# EAGLE design usb-relais-notsmd (EAGLE 5.03)
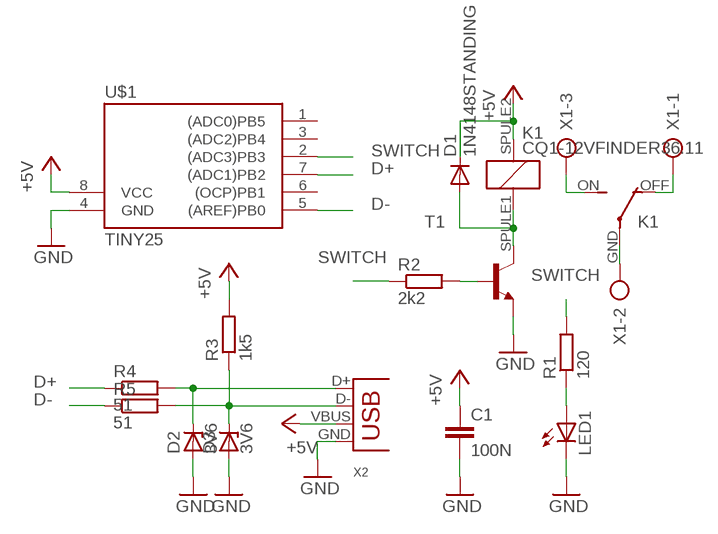
[diagram p0: schematic, sheet 1]

## Parts
C1  100N  C-EU025-024X044  [C025-024X044]
D1  1N4148STANDING  [DO35-3]
D2  3V6  ZENER-DIODEDO35-3  [DO35-3]
D3  3V6  ZENER-DIODEDO35-3  [DO35-3]
K1  CQ1-12VFINDER36.11  [FINDER-36.11]
LED1  LED3MM  [LED3MM]
R1  120  R-EU_0207/2V  [0207/2V]
R2  2k2  R-EU_0207/2V  [0207/2V]
R3  1k5  R-EU_0207/2V  [0207/2V]
R4  51  R-EU_0207/2V  [0207/2V]
R5  51  R-EU_0207/2V  [0207/2V]
T1  BC548C-NPN-TO92-EBC  [TO92-EBC]
U$1  TINY25  [DIL08]
X1  AK500/3  [AK500/3]
X2  USB-B-H  [USB-B-H]

## Nets
+5V: C1.1 D1.C K1.SPULE2 R3.2 U$1.8(VCC) X2.VBUS
D+: R4.1 U$1.7((ADC1)PB2)
D-: R5.1 U$1.5((AREF)PB0)
GND: C1.2 D2.A D3.A LED1.K(C) T1.E U$1.4(GND) X2.GND
N$1: D1.A K1.SPULE1 T1.C
N$2: K1.OFF(2:O) X1.1
N$3: K1.GND(2:P) X1.2
N$4: K1.ON(2:S) X1.3
N$5: LED1.A R1.1
N$6: R2.2 T1.B
N$7: D3.C R3.1 R5.2 X2.D-
N$8: D2.C R4.2 X2.D+
SWITCH: R1.2 R2.1 U$1.2((ADC3)PB3)
Unconnected: U$1.1((ADC0)PB5) U$1.3((ADC2)PB4) U$1.6((OCP)PB1)

## Library data of the parts
C1 = rcl:C-EU: CAPACITOR, European symbol
D1 = diode:1N4148: DIODE high speed (Philips)
D2 D3 = diode:ZENER-DIODE: Z-Diode
K1 = relay:CQ1-12V: AUTOMOTIVE QUIET RELAY NAiS Source: http://www.mew-europe.com/.. en_ds_61208_0000.pdf
LED1 = led:LED: LED OSRAM: - CHIPLED LG R971, LG N971, LY N971, LG Q971, LY Q971, LO R971, LY R971 LH N974, LH R974 LS Q976, LO Q976, LY Q976 LO Q996 - Hyper CHIPLED LW Q18S LB Q993, LB Q99A, LB R99A - SideLED LS A670, LO A670, LY A670, LG A670, LP A670 LB A673, LV A673, LT A673, LW A673 LH A674 LY A675 LS A676, LA A676, LO A676, LY A676, LW A676 LS A679, LY A679, LG A679 - Hyper Micro SIDELED® LS Y876, LA Y876, LO Y876, LY Y876 LT Y87S - SmartLED LW L88C, LW L88S LB L89C, LB L89S, LG L890 LS L89K, LO L89K, LY L89K LS L896, LA L896, LO L896, LY L896 - TOPLED LS T670, LO T670, LY T670, LG T670, LP T670 LSG T670, LSP T670, LSY T670, LOP T670, LYG T670 LG T671, LOG T671, LSG T671 LB T673, LV T673, LT T673, LW T673 LH T674 LS T676, LA T676, LO T676, LY T676, LB T676, LH T676, LSB T676, LW T676 LB T67C, LV T67C, LT T67C, LS T67K, LO T67K, LY T67K, LW E67C LS E67B, LA E67B, LO E67B, LY E67B, LB E67C, LV E67C, LT E67C LW T67C LS T679, LY T679, LG T679 LS T770, LO T770, LY T770, LG T770, LP T770 LB T773, LV T773, LT T773, LW T773 LH T774 LS E675, LA E675, LY E675, LS T675 LS T776, LA T776, LO T776, LY T776, LB T776 LHGB T686 LT T68C, LB T68C - Hyper Mini TOPLED® LB M676 - Mini TOPLED Santana® LG M470 LS M47K, LO M47K, LY M47K Source: http://www.osram.convergy.de LUXEON: - LUMILED® LXK2-PW12-R00, LXK2-PW12-S00, LXK2-PW14-U00, LXK2-PW14-V00 LXK2-PM12-R00, LXK2-PM12-S00, LXK2-PM14-U00 LXK2-PE12-Q00, LXK2-PE12-R00, LXK2-PE12-S00, LXK2-PE14-T00, LXK2-PE14-U00 LXK2-PB12-K00, LXK2-PB12-L00, LXK2-PB12-M00, LXK2-PB14-N00, LXK2-PB14-P00, LXK2-PB14-Q00 LXK2-PR12-L00, LXK2-PR12-M00, LXK2-PR14-Q00, LXK2-PR14-R00 LXK2-PD12-Q00, LXK2-PD12-R00, LXK2-PD12-S00 LXK2-PH12-R00, LXK2-PH12-S00 LXK2-PL12-P00, LXK2-PL12-Q00, LXK2-PL12-R00 Source: www.luxeon.com KINGBRIGHT: KA-3528ASYC Source: www.kingbright.com
R1-R5 = rcl:R-EU_: RESISTOR, European symbol
T1 = transistor:*-NPN-: NPN Transistror BF959 corrected 2008.03.06
U$1 = avr-4:TINY25
X1 = con-ptr500:AK500/3: CONNECTOR
X2 = con-usb-3:USB: USB Connectors

## Board
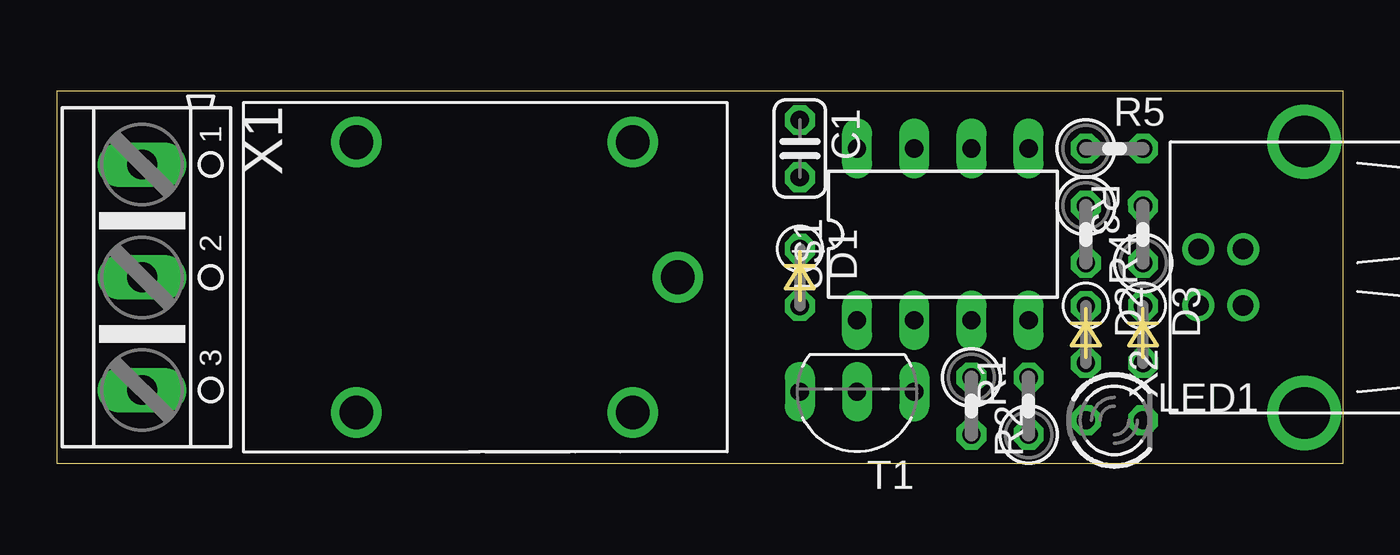
[diagram p1: board, top side]
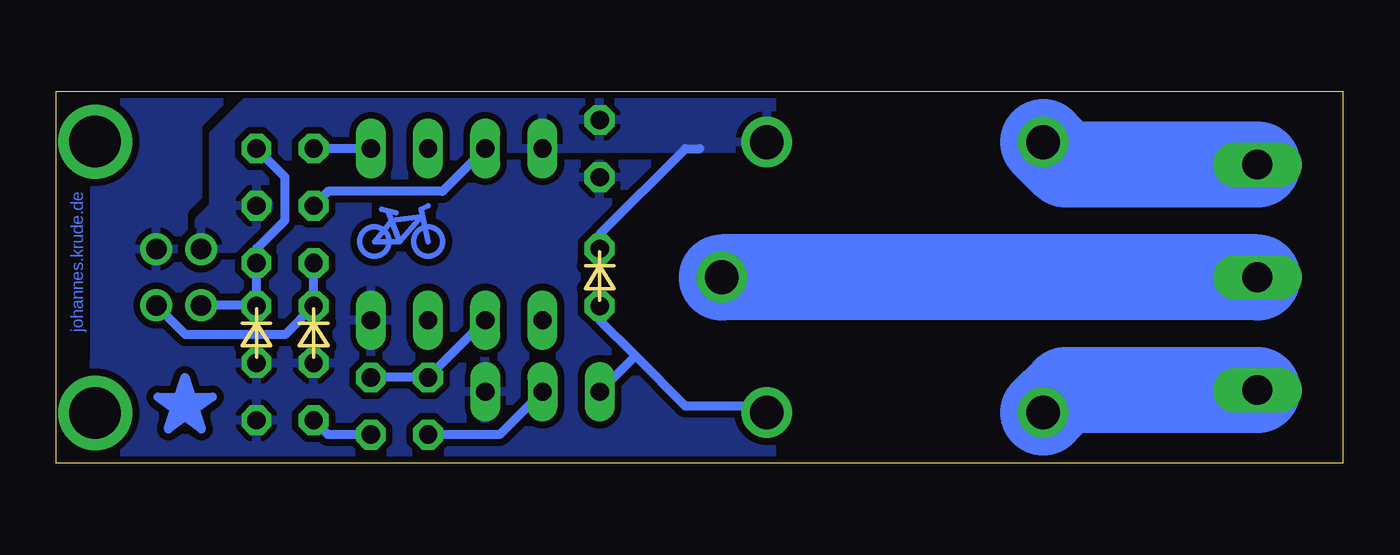
[diagram p2: board, bottom side, seen from below]

Size 57.14 x 16.5 mm. Coordinates in mm from the lower left corner, seen from the top.
Outline: 57.14,16.5 0,16.5 0,0 57.14,0 57.14,16.5
Copper layers (1*16): Top 0.035mm / dielectric 1.5mm / Bottom 0.035mm
Design rules "bÃ¼geln": minimum track width 10mil, minimum drill 24mil, track to track 12mil, track to pad 12mil, pad to pad 8mil, via to via 8mil, smd to smd 8mil, copper to edge 12mil, drill to drill 8mil, minimum pad ring 10mil, minimum via ring 8mil, stop-mask expansion 4mil, vias tented up to drill 0mil, thermal gap 10mil

### Footprints (pad centres in the part's own frame; a part is rotated, then mirrored left to right if it is on the bottom)
C025-024X044 = drill 0.813 octagon: 1 -1.27,0; 2 1.27,0
DO35-3 = drill 0.813 octagon: A 1.27,0; C -1.27,0
FINDER-36.11 = drill 1.5 round: GND -8.55,0; OFF 5.72,-6; ON 5.72,6; SPULE1 -6.55,6; SPULE2 -6.55,-6
LED3MM = drill 0.813 octagon: A -1.27,0; K 1.27,0
0207/2V = drill 0.813 octagon: 1 -1.27,0; 2 1.27,0
TO92-EBC = drill 0.813 long: B 0,-1.27; C 2.54,-1.27; E -2.54,-1.27
DIL08 = drill 0.813 long: 1 -3.81,-3.81; 2 -1.27,-3.81; 3 1.27,-3.81; 4 3.81,-3.81; 5 3.81,3.81; 6 1.27,3.81; 7 -1.27,3.81; 8 -3.81,3.81
AK500/3 = drill 1.321 long: 1 -5.004,0; 2 0,0; 3 5.004,0
USB-B-H = drill 0.914 round: D+ 0,1.25; D- 1.981,1.25; GND 0,-1.25; VBUS 1.981,-1.25 | drill 2.286 round: P$1 -2.718,-6.02; P$2 -2.718,6.02

### Placement (x,y rotation side)
C1  33.01,13.96 270 top
D1  33.01,8.25 270 top
D2  45.71,5.71 270 top
D3  48.25,5.71 270 top
K1  19.04,8.25 180 top
LED1  46.98,1.9 0 top
R1  43.17,2.53 90 top
R2  40.63,2.53 270 top
R3  48.25,10.15 90.1 top
R4  45.71,10.15 270 top
R5  46.98,13.96 0 top
T1  35.55,1.9 180 top
U$1  39.36,10.15 0 top
X1  3.8,8.25 270 top
X2  52.69,8.25 180 top

### Tracks (layer width: path | path; a pad name or v marks a point on that pad's centre or on a via)
+5V
  Bottom 0.406: D1.C 33.01,10.15 29.2,13.96 28.56,13.96
  pour Bottom: 48.25,16.5 25.39,16.5 25.39,13.96 38.09,13.96 38.09,12.69 47.61,12.69 47.61,9.52 50.79,9.52 50.79,10.79 50.15,11.42 50.15,14.6
D+
  Bottom 0.406: U$1.7 39.99,12.05 45.07,12.05 R4.1
D-
  Bottom 0.406: U$1.5 R5.1
GND
  pour Bottom (rank 2): 57.14,16.5 25.39,16.5 25.39,13.96 28.56,13.96 33.01,9.52 33.01,6.98 28.56,2.53 25.39,2.53 25.39,-0.01 57.14,-0.01
N$1
  Bottom 0.406: D1.A 33.01,6.34 31.42,4.75 | 31.42,4.75 29.2,2.53 25.87,2.53 K1.SPULE1 | 31.42,4.75 T1.C
N$2
  Bottom 3.81: X1.1 12.32,13.25 K1.OFF
N$3
  Bottom 3.81: X1.2 K1.GND
N$4
  Bottom 3.81: X1.3 12.32,3.24 K1.ON
N$5
  Bottom 0.406: R1.1 45.07,1.26 LED1.A
N$6
  Bottom 0.406: T1.B 37.45,1.26 R2.2
N$7
  Bottom 0.406: X2.D- 48.27,7 D3.C R3.1 48.25,9.51 48.25,9.52 46.98,10.79 46.98,12.69 R5.2
N$8
  Bottom 0.406: R4.2 D2.C 46.98,5.71 51.4,5.71 X2.D+
N$9
  Bottom 0.254: 41.9,9.83 43.01,9.83 42.21,10.79 40.94,10.94 41.9,9.83 | 41.9,9.83 42.37,11.1
N$10
  Bottom 0.254: 40.63,9.83 40.94,11.26
N$11
  Bottom 0.254: 42.69,11.26 42.06,11.1
N$12
  Bottom 0.254: 40.63,11.42 40.95,11.26
N$13
  Bottom 0.406: 52.16,1.5 50.21,2.92 52.63,2.92 50.68,1.5 51.42,3.8
N$14
  Bottom 0.406: 52.16,1.5 51.42,3.8
SWITCH
  Bottom 0.406: R1.2 R2.1 U$1.2
(copper drawn outside any net)
  shapes: Bottom area x1, Bottom circle x2

### Text on the board
Bottom: johannes.krude.de